# Altium schematic sheet GLCD.SchDoc: GLCD
size A4; Organization: BME AUT; Address1: Magyar tudósok krt. 2.; Address2: Q épület; Address3: Budapest; Address4: H-1117; DocumentNumber: 1; Revision: 1.0; SheetNumber: 1; SheetTotal: 2
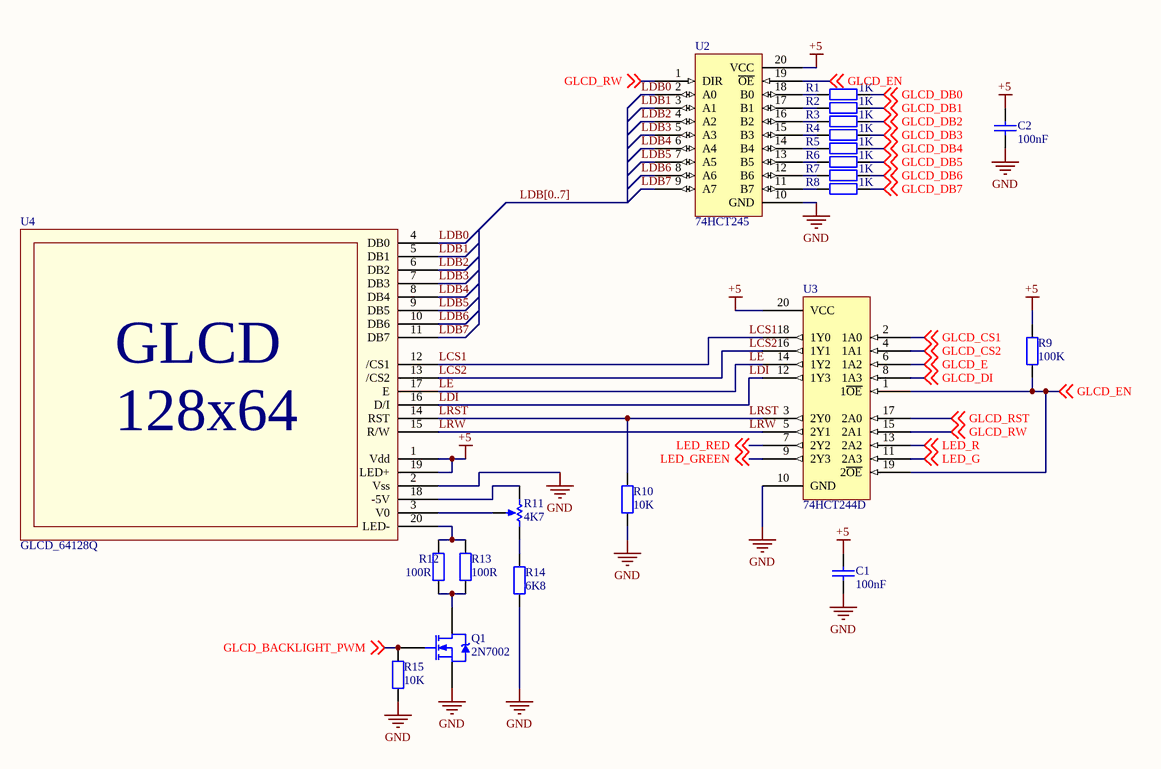
[diagram p0: GLCD.SchDoc]

## Parts
C1  100nF  [FP_0805_CAP_085]
C2  100nF  [FP_0805_CAP_085]
Q1  2N7002  [FP_SOT23-3]
R1  1K  [FP_0805_RES]
R2  1K  [FP_0805_RES]
R3  1K  [FP_0805_RES]
R4  1K  [FP_0805_RES]
R5  1K  [FP_0805_RES]
R6  1K  [FP_0805_RES]
R7  1K  [FP_0805_RES]
R8  1K  [FP_0805_RES]
R9  100K  [FP_0805_RES]
R10  10K  [FP_0805_RES]
R11  4K7  [FP_CERMET_SMD]
R12  100R  [FP_0805_RES]
R13  100R  [FP_0805_RES]
R14  6K8  [FP_0805_RES]
R15  10K  [FP_0805_RES]
U2  74HCT245  [FP_SOP127P1030X265-20M]
U3  74HCT244D  [FP_SOP127P1030X265-20M]
U4  GLCD_64128Q  [FP_GLCD_64128Q]

## Nets
+5: C1.2 C2.2 R9.2 U2.20(VCC) U3.20(VCC) U4.1(Vdd) U4.19(LED+)
GND: C1.1 C2.1 Q1.3(S) R10.1 R14.1 R15.1 U2.10(GND) U3.10(GND) U4.2(Vss)
GLCD_BACKLIGHT_PWM: Q1.1(G) R15.2 ; off-sheet GLCD_BACKLIGHT_PWM
GLCD_CS1: U3.2(1A0) ; off-sheet GLCD_CS1
GLCD_CS2: U3.4(1A1) ; off-sheet GLCD_CS2
GLCD_DB0: R1.2 ; off-sheet GLCD_DB0
GLCD_DB1: R2.2 ; off-sheet GLCD_DB1
GLCD_DB2: R3.2 ; off-sheet GLCD_DB2
GLCD_DB3: R4.2 ; off-sheet GLCD_DB3
GLCD_DB4: R5.2 ; off-sheet GLCD_DB4
GLCD_DB5: R6.2 ; off-sheet GLCD_DB5
GLCD_DB6: R7.2 ; off-sheet GLCD_DB6
GLCD_DB7: R8.2 ; off-sheet GLCD_DB7
GLCD_DI: U3.8(1A3) ; off-sheet GLCD_DI
GLCD_E: U3.6(1A2) ; off-sheet GLCD_E
GLCD_EN: R9.1 U2.19(~{OE}) U3.1(1~{OE}) U3.19(2~{OE}) ; off-sheet GLCD_EN
GLCD_RST: U3.17(2A0) ; off-sheet GLCD_RST
GLCD_RW: U2.1(DIR) U3.15(2A1) ; off-sheet GLCD_RW
LCS1: U3.18(1Y0) U4.12(/CS1)
LCS2: U3.16(1Y1) U4.13(/CS2)
LDB0: U2.2(A0) U4.4(DB0)
LDB1: U2.3(A1) U4.5(DB1)
LDB2: U2.4(A2) U4.6(DB2)
LDB3: U2.5(A3) U4.7(DB3)
LDB4: U2.6(A4) U4.8(DB4)
LDB5: U2.7(A5) U4.9(DB5)
LDB6: U2.8(A6) U4.10(DB6)
LDB7: U2.9(A7) U4.11(DB7)
LDI: U3.12(1Y3) U4.16(D/I)
LE: U3.14(1Y2) U4.17(E)
LED_G: U3.11(2A3) ; off-sheet LED_G
LED_GREEN: U3.9(2Y3) ; off-sheet LED_GREEN
LED_R: U3.13(2A2) ; off-sheet LED_R
LED_RED: U3.7(2Y2) ; off-sheet LED_RED
LRST: R10.2 U3.3(2Y0) U4.14(RST)
LRW: U3.5(2Y1) U4.15(R/W)
NetQ1_2: Q1.2(D) R12.1 R13.1
NetR1_1: R1.1 U2.18(B0)
NetR2_1: R2.1 U2.17(B1)
NetR3_1: R3.1 U2.16(B2)
NetR4_1: R4.1 U2.15(B3)
NetR5_1: R5.1 U2.14(B4)
NetR6_1: R6.1 U2.13(B5)
NetR7_1: R7.1 U2.12(B6)
NetR8_1: R8.1 U2.11(B7)
NetR11_1: R11.1(CCW) U4.18(-5V)
NetR11_2: R11.2(WIPER) U4.3(V0)
NetR11_3: R11.3(CW) R14.2
NetR12_2: R12.2 R13.2 U4.20(LED-)

## Buses and harness runs
bus LDB[0..7]

## Notes on the sheet
- Title
- Size:
- Date:
- A4
- Number:
- Time:
- Revision:
- Sheet
- of
- File:
- (in symbol GLCD_64128Q) GLCD; 128x64

## Library data of the parts
C1 C2 = CAP 100nF: Capacitor; Tolerance: 10%; Voltage: 50V; Name: 100nF 0805 10% 50V X7R 0805B104K500CT (WAL); Supplier: Lomex; Reference: 82-10-76; Value: 100nF
Q1 = 2N7002: N-channel MOSFET; pin to pad: 2>3 3>2; Name: MOSFET Transistor, N Channel, 300mA, 60V, 2.8 ohm, 10V, 2V; Voltage: 60V; Current: 300mA; Supplier: Lomex; Reference: 86-05-52
R1-R8 = RES 1K: Resistor; Tolerance: 5%; Power: 125mW; Name: 1K00 0805 5% WR08X102JTL 0.125W (WAL); Supplier: Lomex; Reference: 81-27-93; Value: 1K
R9 = RES 100K: Resistor; Tolerance: 5%; Power: 125mW; Name: 100K 0805 5% WR08X104JTL 0.125W (WAL); Supplier: Lomex; Reference: 81-30-68; Value: 100K
R10 R15 = RES 10K: Resistor; Tolerance: 5%; Power: 125mW; Name: 10K0 0805 5% CR-05JL7---10K 0.125W (VIK); Supplier: Lomex; Reference: 81-30-45; Value: 10K
R11 = Cermet Pot 4K7: 4K70 3305-472R (KIC) 3x3.8mm CERMET; Reference: 90-00-68; Supplier: Lomex; Name: 4K70 3305-472R (KIC) 3x3.8mm CERMET; Value: 4K7
R12 R13 = RES 100R: Resistor; Tolerance: 5%; Power: 125mW; Name: 100R 0805 5% WR08X101JTL 0.125W (WAL); Supplier: Lomex; Reference: 81-30-00; Value: 100R
R14 = RES 6K8: Resistor; Tolerance: 5%; Power: 125mW; Name: 6K80 0805 5% WR08X682JTL 0.125W (WAL); Supplier: Lomex; Reference: 81-30-41; Value: 6K8
U2 = 74HCT245: 8x Bidirectional bus transciever; Name: 74HCT245D  Transceiver, 74HCT245; Supplier: Lomex; Reference: 87-06-35
U3 = 74HCT244D: 8xBuffer/Line Driver; Name: 74HCT244D-Q100,118  Buffer / Line Driver, 74HCT244; Reference: 87-05-95; Supplier: Lomex
U4 = GLCD_64128Q: 64128QCCBW-3LP; Name: 128x 64 DOT LIGHT:LED 64128QCCBW-3LP (DIS) 0.4/DOT 75x53mm BLUE STN LOW.POW. WIDE TEMP. (CONTROLLER/DRIVER: SBN6400G-D + SBN0064G-D); Supplier: Lomex; Reference: 37-00-71